# EAGLE design streifen (EAGLE 6.5.0)
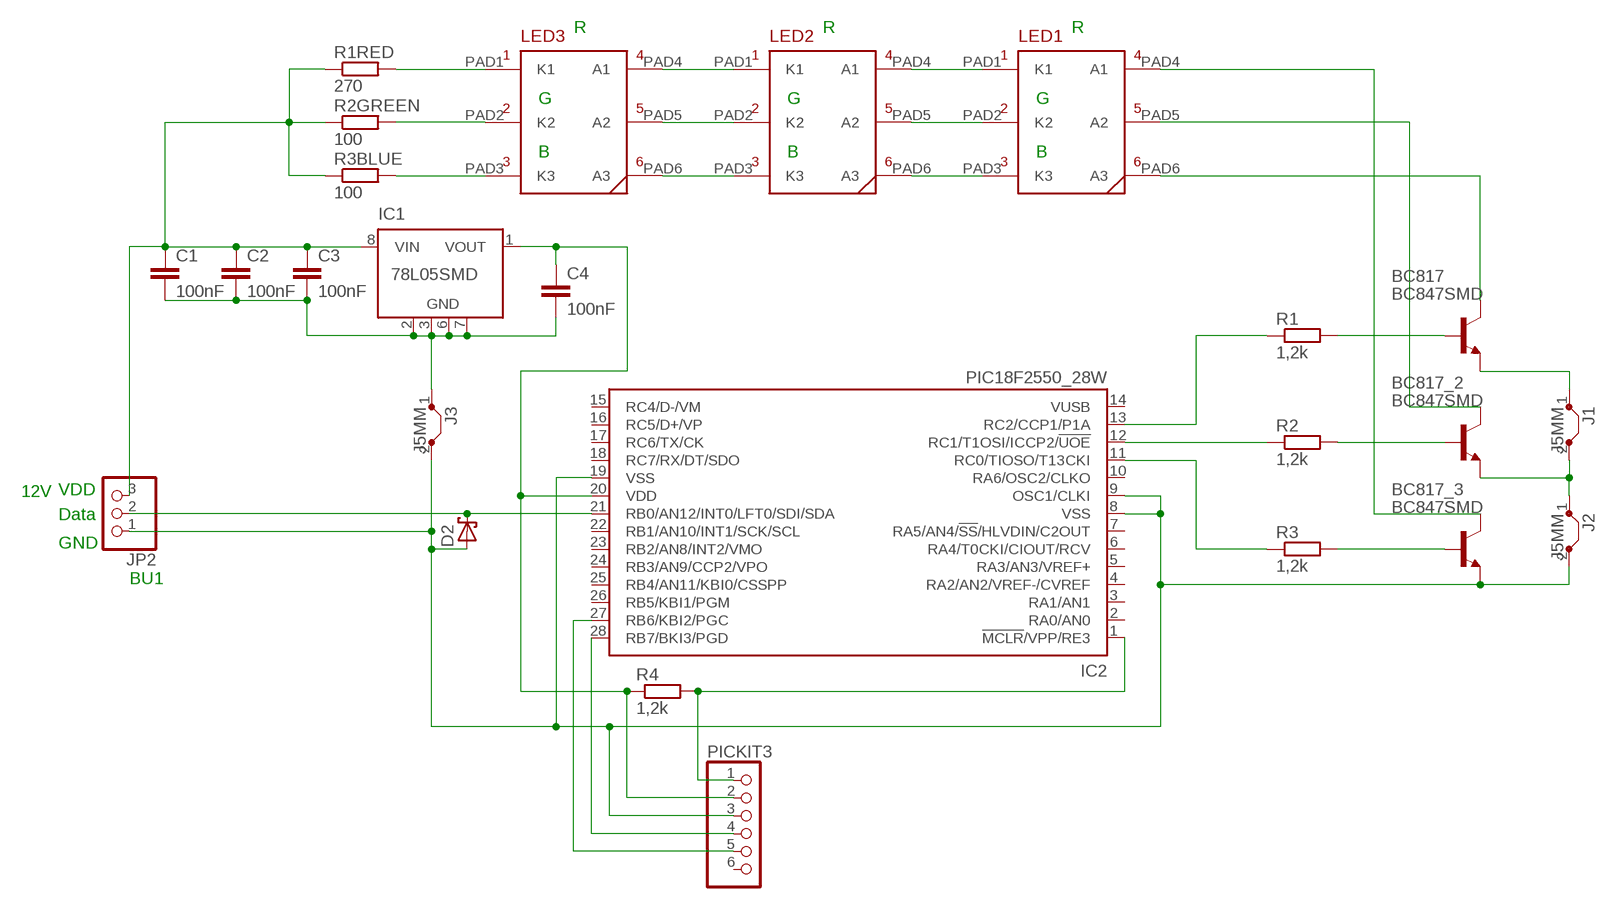
[diagram p0: schematic, sheet 1]

## Parts
BC817  BC847SMD  [SOT23]
BC817_2  BC847SMD  [SOT23]
BC817_3  BC847SMD  [SOT23]
C1  100nF  C-EUC1206  [C1206]
C2  100nF  C-EUC1206  [C1206]
C3  100nF  C-EUC1206  [C1206]
C4  100nF  C-EUC1206  [C1206]
D2  SCHOTTKY-DIODEDO35-7  [DO35-7]
IC1  78L05SMD  [SO08]
IC2  PIC18F2550_28W  [SO28W]
J1  J5MM  [05]
J2  J5MM  [05]
J3  J5MM  [05]
JP2  PINHD-1X3  [1X03]
LED1  LP6-EWN1-03-N3  [PLCC6]
LED2  LP6-EWN1-03-N3  [PLCC6]
LED3  LP6-EWN1-03-N3  [PLCC6]
PICKIT3  PINHD-1X6  [1X06]
R1  1,2k  R-EU_R1206  [R1206]
R1RED  270  R-EU_R1206  [R1206]
R2  1,2k  R-EU_R1206  [R1206]
R2GREEN  100  R-EU_R1206  [R1206]
R3  1,2k  R-EU_R1206  [R1206]
R3BLUE  100  R-EU_R1206  [R1206]
R4  1,2k  R-EU_R1206  [R1206]

## Nets
GND: BC817_3.2(E) C1.2 C2.2 C3.2 C4.2 D2.A IC1.2(GND) IC1.3(GND) IC1.6(GND) IC1.7(GND) IC2.8(VSS) IC2.9(OSC1/CLKI) IC2.19(VSS) J2.2 J3.1 J3.2 JP2.1 PICKIT3.3
N$1: BC817_3.3(C) LED1.PAD4(A1)
N$2: IC2.13(RC2/CCP1/P1A) R1.1
N$3: D2.C IC2.21(RB0/AN12/INT0/LFT0/SDI/SDA) JP2.2
N$4: IC2.1(!MCLR!/VPP/RE3) PICKIT3.1 R4.2
N$5: BC817_2.3(C) LED1.PAD5(A2)
N$6: BC817.3(C) LED1.PAD6(A3)
N$7: C4.1 IC1.1(VOUT) IC2.20(VDD) PICKIT3.2 R4.1
N$8: IC2.12(RC1/T1OSI/ICCP2/!UOE) R2.1
N$9: IC2.11(RC0/TIOSO/T13CKI) R3.1
N$10: LED1.PAD3(K3) LED2.PAD6(A3)
N$11: LED1.PAD2(K2) LED2.PAD5(A2)
N$12: LED1.PAD1(K1) LED2.PAD4(A1)
N$13: LED2.PAD3(K3) LED3.PAD6(A3)
N$14: LED2.PAD2(K2) LED3.PAD5(A2)
N$15: LED2.PAD1(K1) LED3.PAD4(A1)
N$16: C1.1 C2.1 C3.1 IC1.8(VIN) JP2.3 R1RED.1 R2GREEN.1 R3BLUE.1
N$17: LED3.PAD1(K1) R1RED.2
N$18: LED3.PAD2(K2) R2GREEN.2
N$19: LED3.PAD3(K3) R3BLUE.2
N$20: BC817.1(B) R1.2
N$21: BC817_2.1(B) R2.2
N$22: BC817_3.1(B) R3.2
N$23: IC2.28(RB7/BKI3/PGD) PICKIT3.4
N$24: IC2.27(RB6/KBI2/PGC) PICKIT3.5
N$25: BC817_2.2(E) J1.2 J2.1
N$26: BC817.2(E) J1.1
Unconnected: IC1.4(NC) IC1.5(NC) IC2.2(RA0/AN0) IC2.3(RA1/AN1) IC2.4(RA2/AN2/VREF-/CVREF) IC2.5(RA3/AN3/VREF+) IC2.6(RA4/T0CKI/CIOUT/RCV) IC2.7(RA5/AN4/!SS!/HLVDIN/C2OUT) IC2.10(RA6/OSC2/CLKO) IC2.14(VUSB) IC2.15(RC4/D-/VM) IC2.16(RC5/D+/VP) IC2.17(RC6/TX/CK) IC2.18(RC7/RX/DT/SDO) IC2.22(RB1/AN10/INT1/SCK/SCL) IC2.23(RB2/AN8/INT2/VMO) IC2.24(RB3/AN9/CCP2/VPO) IC2.25(RB4/AN11/KBI0/CSSPP) IC2.26(RB5/KBI1/PGM) PICKIT3.6

## Notes on the sheet
- R | R | R
- G | G | G
- B | B | B
- 12V | VDD
- Data
- GND
- BU1

## Library data of the parts
BC817 BC817_2 BC817_3 = transistor-npn:BC847*: NPN Transistor
C1-C4 = rcl:C-EU: CAPACITOR, European symbol
D2 = diode:SCHOTTKY-DIODE: Schottky Diode
IC1 = linear:78L*SMD: Positive VOLTAGE REGULATOR
IC2 = microchip:PIC18F2*_28: USB Microcontrollers with nanoWatt Technology High-Performance, Enhanced Flash, 28/40/44-Pin, Source: http://ww1.microchip.com/downloads/en/devicedoc/39632c.pdf; MF: MICROCHIP; MPN: PIC18F2550-I/SO; OC_FARNELL: 9321268; OC_NEWARK: 73K1297
J1-J3 = jumper:J: Bridge
JP2 = pinhead:PINHD-1X3: PIN HEADER
LED1-LED3 = led_cree:LP6-EWN1-03-N3: Cree 3 Chip SMD High-Power Led
PICKIT3 = pinhead:PINHD-1X6: PIN HEADER
R1 R1RED R2 R2GREEN R3 R3BLUE R4 = rcl:R-EU_: RESISTOR, European symbol

## Board
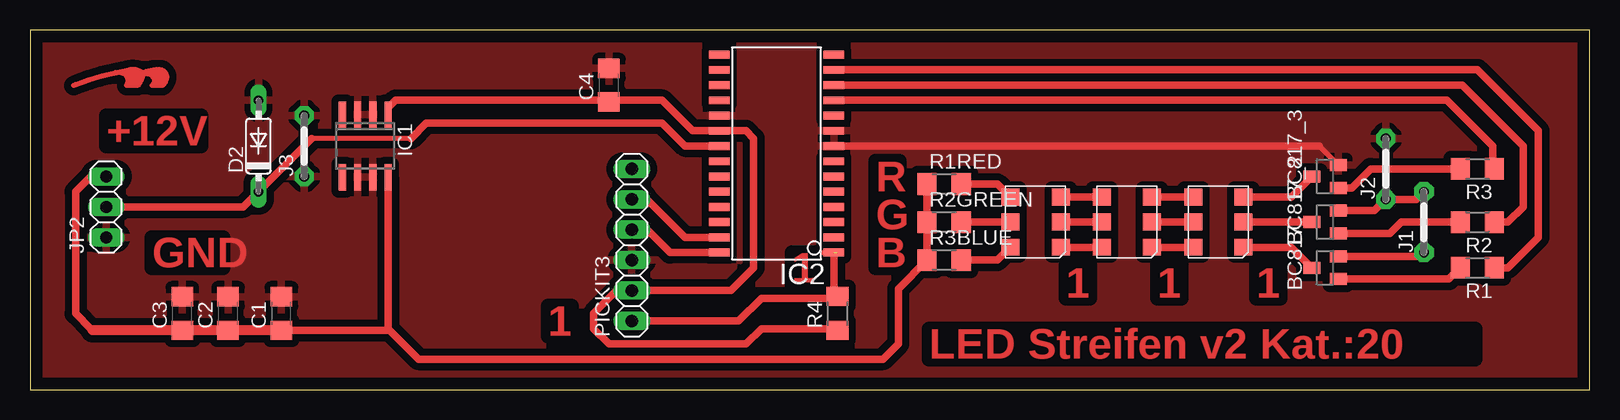
[diagram p1: board, top side]

Size 130 x 30 mm. Coordinates in mm from the lower left corner, seen from the top.
Outline: 0,0 130,0 130,30 0,30 0,0
Copper layers (1*16): Top 0.035mm / dielectric 1.5mm / Bottom 0.035mm
Design rules "default *": minimum track width 16mil, minimum drill 31mil, track to track 24mil, track to pad 24mil, pad to pad 24mil, via to via 24mil, smd to smd 20mil, copper to edge 40mil, drill to drill 16mil, minimum pad ring 10mil, minimum via ring 16mil, stop-mask expansion 4mil, vias tented up to drill 0mil, thermal gap 20mil

### Footprints (pad centres in the part's own frame; a part is rotated, then mirrored left to right if it is on the bottom)
SOT23 = smd 1 x 1.4: 1 -0.95,-1.1; 2 0.95,-1.1; 3 0,1.1
C1206 = smd 1.6 x 1.8: 1 -1.4,0; 2 1.4,0
DO35-7 = drill 0.813 long: A 3.81,0; C -3.81,0
SO08 = smd 0.6 x 2.2: 1 -1.905,-2.6; 2 -0.635,-2.6; 3 0.635,-2.6; 4 1.905,-2.6; 5 1.905,2.6; 6 0.635,2.6; 7 -0.635,2.6; 8 -1.905,2.6
SO28W = smd 0.65 x 1.7: 1 -7.62,-4.78; 2 -6.35,-4.78; 3 -5.08,-4.78; 4 -3.81,-4.78; 5 -2.54,-4.78; 6 -1.27,-4.78; 7 0,-4.78; 8 1.27,-4.78; 9 2.54,-4.78; 10 3.81,-4.78; 11 5.08,-4.78; 12 6.35,-4.78; 13 7.62,-4.78; 14 8.89,-4.78; 15 8.89,4.78; 16 7.62,4.78; 17 6.35,4.78; 18 5.08,4.78; 19 3.81,4.78; 20 2.54,4.78; 21 1.27,4.78; 22 0,4.78; 23 -1.27,4.78; 24 -2.54,4.78; 25 -3.81,4.78; 26 -5.08,4.78; 27 -6.35,4.78; 28 -7.62,4.78
05 = drill 0.813 pad 1.6 octagon: 1 -2.54,0; 2 2.54,0
1X03 = drill 1.016 long: 1 -2.54,0; 2 0,0; 3 2.54,0
PLCC6 = smd 1.5 x 1.4: PAD1 -2.1,2.1; PAD2 -2.1,0; PAD3 -2.1,-2.1; PAD4 2.1,2.1; PAD5 2.1,0; PAD6 2.1,-2.1
1X06 = drill 1.016 long: 1 -6.35,0; 2 -3.81,0; 3 -1.27,0; 4 1.27,0; 5 3.81,0; 6 6.35,0
R1206 = smd 1.6 x 1.803: 1 -1.422,0; 2 1.422,0

### Placement (x,y rotation side)
BC817  107.95,10.16 90 top
BC817_2  107.95,13.97 90 top
BC817_3  107.95,17.78 90 top
C1  20.95,6.35 90 top
C2  16.51,6.35 90 top
C3  12.7,6.35 90 top
C4  48.26,25.4 90 top
D2  19.05,20.32 90 top
IC1  27.94,20.32 180 top
IC2  62.23,19.05 90 top
J1  116.2,13.97 90 top
J2  113.03,18.41 90 top
J3  22.86,20.32 90 top
JP2  6.35,15.24 90 top
LED1  99.06,13.97 0 top
LED2  91.44,13.97 0 top
LED3  83.82,13.97 0 top
PICKIT3  50.16,12.06 90 top
R1  120.65,10.16 180 top
R1RED  76.2,17.14 0 top
R2  120.65,13.97 180 top
R2GREEN  76.2,13.97 0 top
R3  120.65,18.41 180 top
R3BLUE  76.2,10.79 0 top
R4  67.31,6.35 90 top
U$1  [LOGOTOP_8]  8.89,25.4 0 top

### Tracks (layer width: path | path; a pad name or v marks a point on that pad's centre or on a via)
GND  (1 unrouted)
  Top 0.406: 107.46,20.32 BC817_3.2
  Top 0.61: IC2.8 107.46,20.32
  pour Top: 0,30.48 130.81,30.48 130.81,0 0,0
  pour Top: 0,0 130.18,0 130.18,29.84 0,29.84
N$1
  Top 0.61: LED1.PAD4 105.14,16.07 BC817_3.3
N$2
  Top 0.61: IC2.13 120.65,26.67 125.73,21.59 125.73,12.7 123.19,10.16 R1.1
N$3
  Top 0.406: 31.75,20.95 23.5,20.95
  Top 0.61: IC2.21 54.61,20.32 52.7,22.23 33.02,22.23 31.75,20.95 | JP2.2 17.78,15.24 D2.C 23.5,20.95
N$4  (1 unrouted)
  Top 0.406: 66.04,11.43 IC2.1 | 67.46,11.28 67.31,11.43 | 67.01,8.07 R4.2 67.16,7.62
  Top 0.61: IC2.1 67.01,8.07 | 67.16,7.62 60.96,7.62 59.05,5.71 PICKIT3.1
N$5
  Top 0.61: LED1.PAD5 BC817_2.3
N$6
  Top 0.61: LED1.PAD6 105.14,11.87 BC817.3
N$7
  Top 0.406: IC1.1 29.91,22.86 29.91,23.55 | 67.16,5.08 R4.1 | 48.13,24.13 C4.1
  Top 0.61: 29.91,23.55 30.48,24.13 48.13,24.13 | 67.16,5.08 60.96,5.08 59.69,3.81 48.26,3.81 46.99,5.08 46.99,6.35 48.9,8.26 PICKIT3.2 58.42,8.26 60.33,10.16 60.33,20.95 59.69,21.59 IC2.20 55.24,21.59 52.7,24.13 48.39,24.13 C4.1
N$8
  Top 0.61: IC2.12 119.38,25.4 124.46,20.32 124.46,15.24 123.19,13.97 R2.1
N$9
  Top 0.61: IC2.11 118.11,24.13 121.92,20.32 121.92,18.57 R3.1
N$10
  Top 0.61: LED1.PAD3 LED2.PAD6
N$11
  Top 0.61: LED2.PAD5 LED1.PAD2
N$12
  Top 0.61: LED1.PAD1 LED2.PAD4
N$13
  Top 0.61: LED2.PAD3 LED3.PAD6
N$14
  Top 0.61: LED3.PAD5 LED2.PAD2
N$15
  Top 0.61: LED2.PAD1 LED3.PAD4
N$16
  Top 0.406: 29.84,5.08 29.84,4.95 | R3BLUE.1 74.78,10.31 74.93,10.16 74.93,10.64 R3BLUE.1
  Top 0.61: R1RED.1 R2GREEN.1 R3BLUE.1 72.39,8.41 72.39,3.81 71.12,2.54 32.38,2.54 29.84,5.08 IC1.8 | C1.1 29.84,4.95 | JP2.3 5.08,17.78 3.81,16.51 3.81,6.35 5.08,5.08 12.57,5.08 C3.1
  Top 0.813: C1.1 C2.1 C3.1 5.21,4.95
N$17
  Top 0.61: R1RED.2 80.64,17.14 LED3.PAD1
N$18
  Top 0.61: R2GREEN.2 LED3.PAD2
N$19
  Top 0.61: R3BLUE.2 80.64,10.79 LED3.PAD3
N$20
  Top 0.61: BC817.1 118.28,9.21 R1.2
N$21
  Top 0.61: BC817_2.1 113.35,13.02 114.3,13.97 R2.2
N$22
  Top 0.61: BC817_3.1 110.17,16.83 111.76,18.41 R3.2
N$23
  Top 0.61: IC2.28 53.34,11.43 51.44,13.34 PICKIT3.4
N$24
  Top 0.61: IC2.27 54.61,12.7 51.44,15.88 PICKIT3.5
N$25
  Top 0.61: BC817_2.2 112.08,14.92 J2.1 115.57,15.88 J1.2
N$26
  Top 0.61: BC817.2 115.89,11.11 J1.1

### Text on the board
Top: +12V | R | G | GND | B | 1 | 1 | 1 | 1 | 1 | LED Streifen v2 Kat.:20